# Altium schematic sheet MCU_OBDH_Transceiver.SchDoc: FloripaSat / OBDHTTC Subsystem /  OBDH Microcontroller
size A2; SheetNumber: 3; SheetTotal: 11
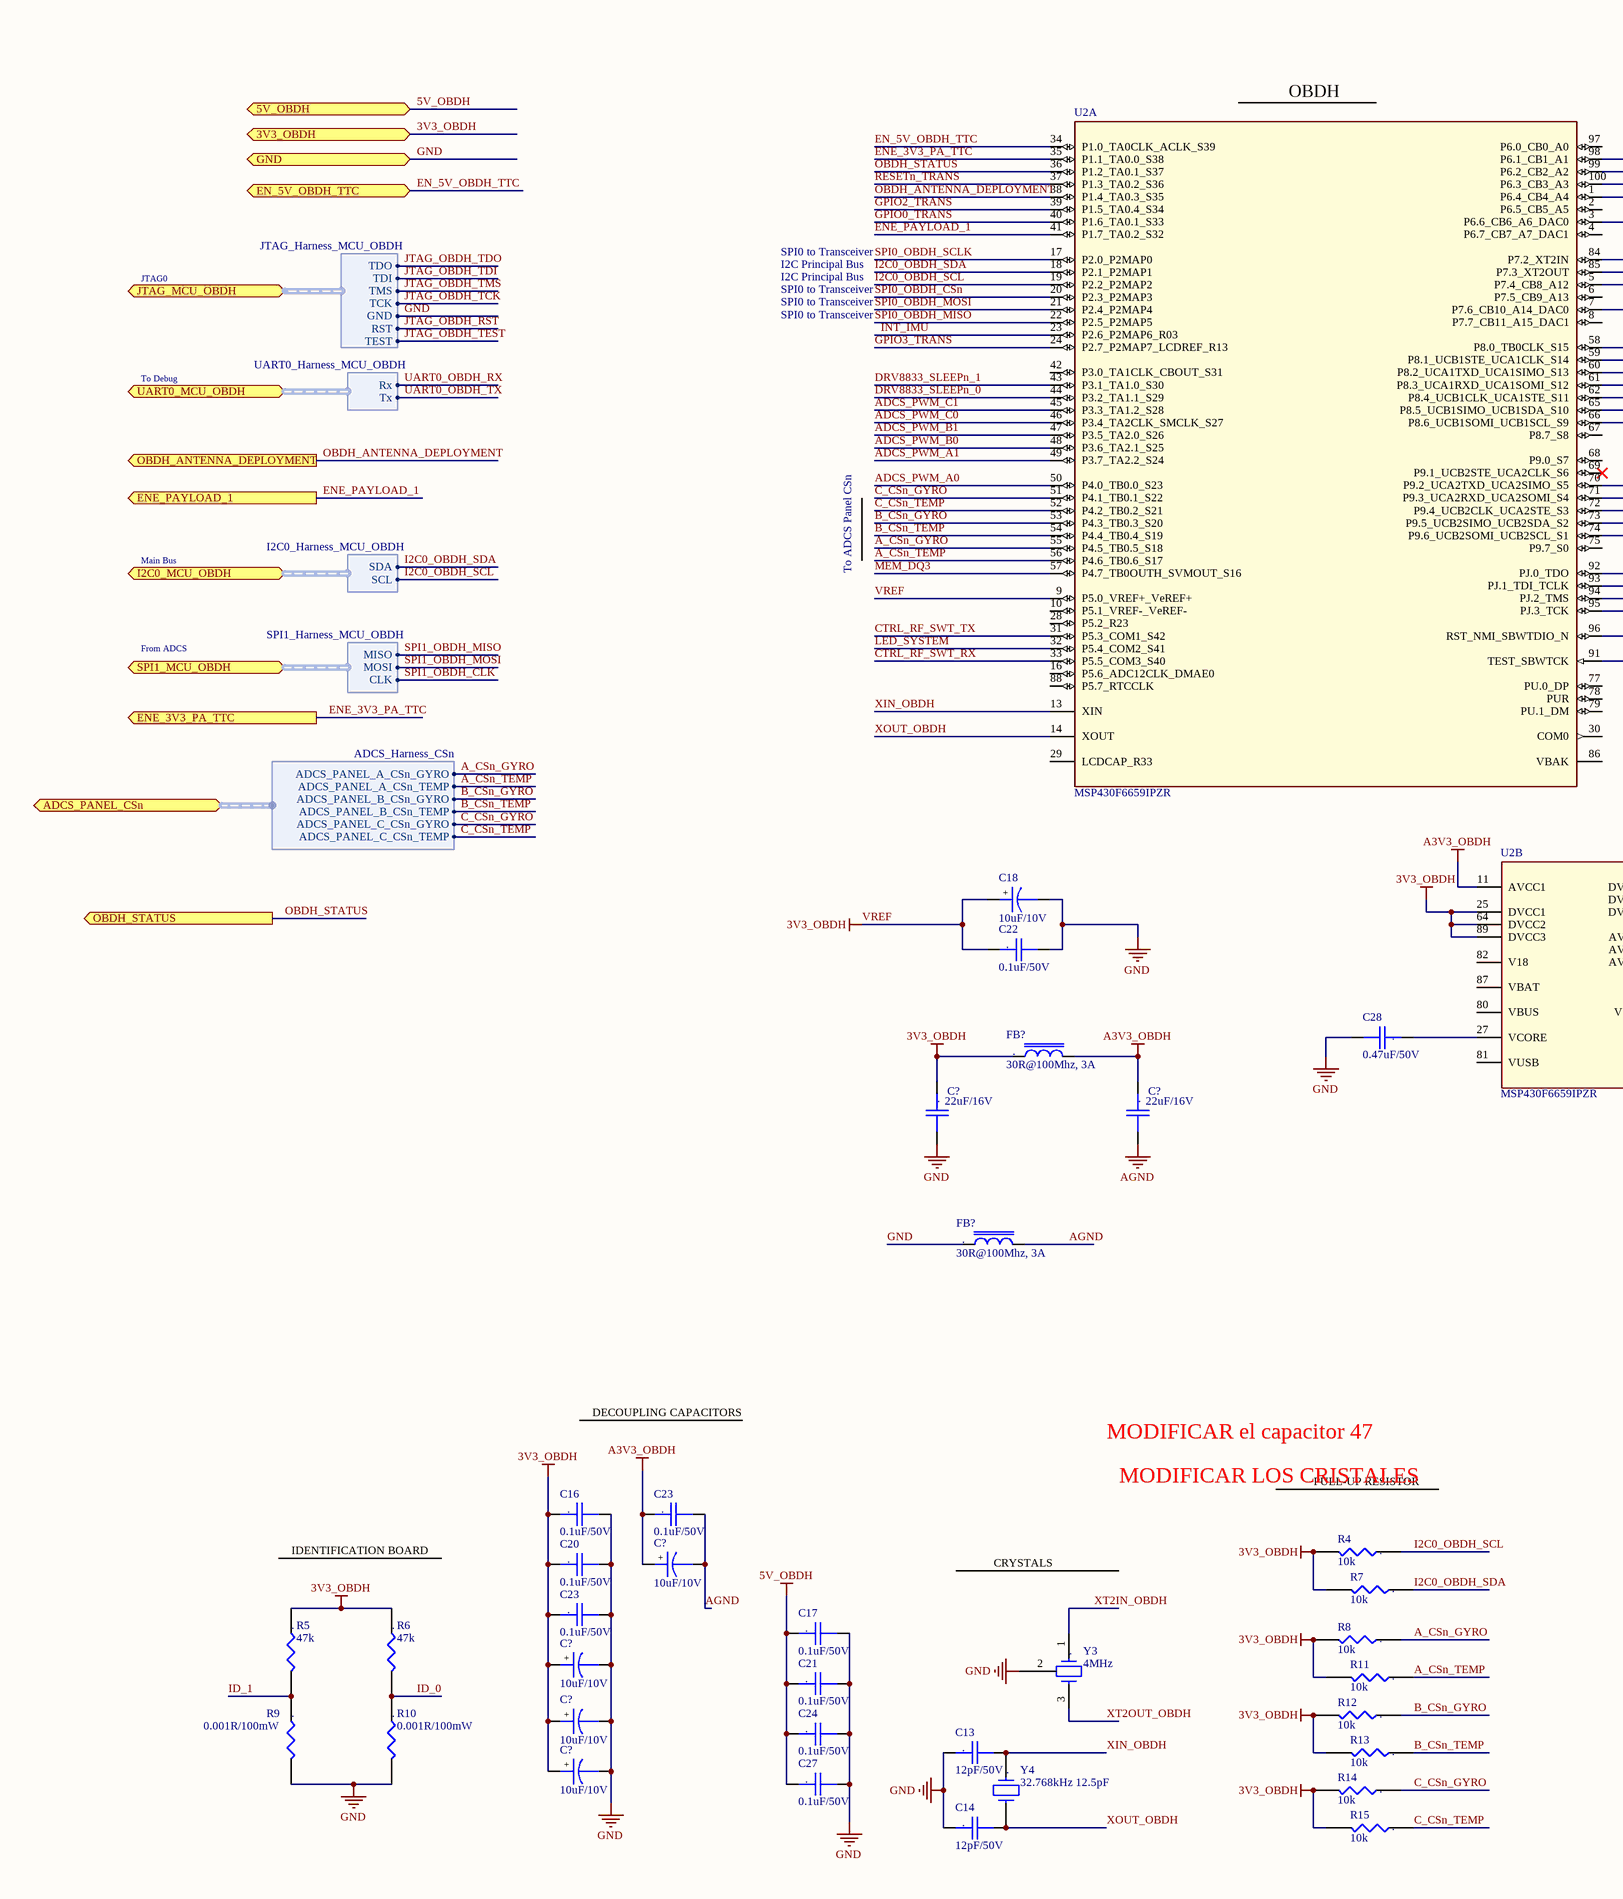
[diagram p0: MCU_OBDH_Transceiver.SchDoc, left]
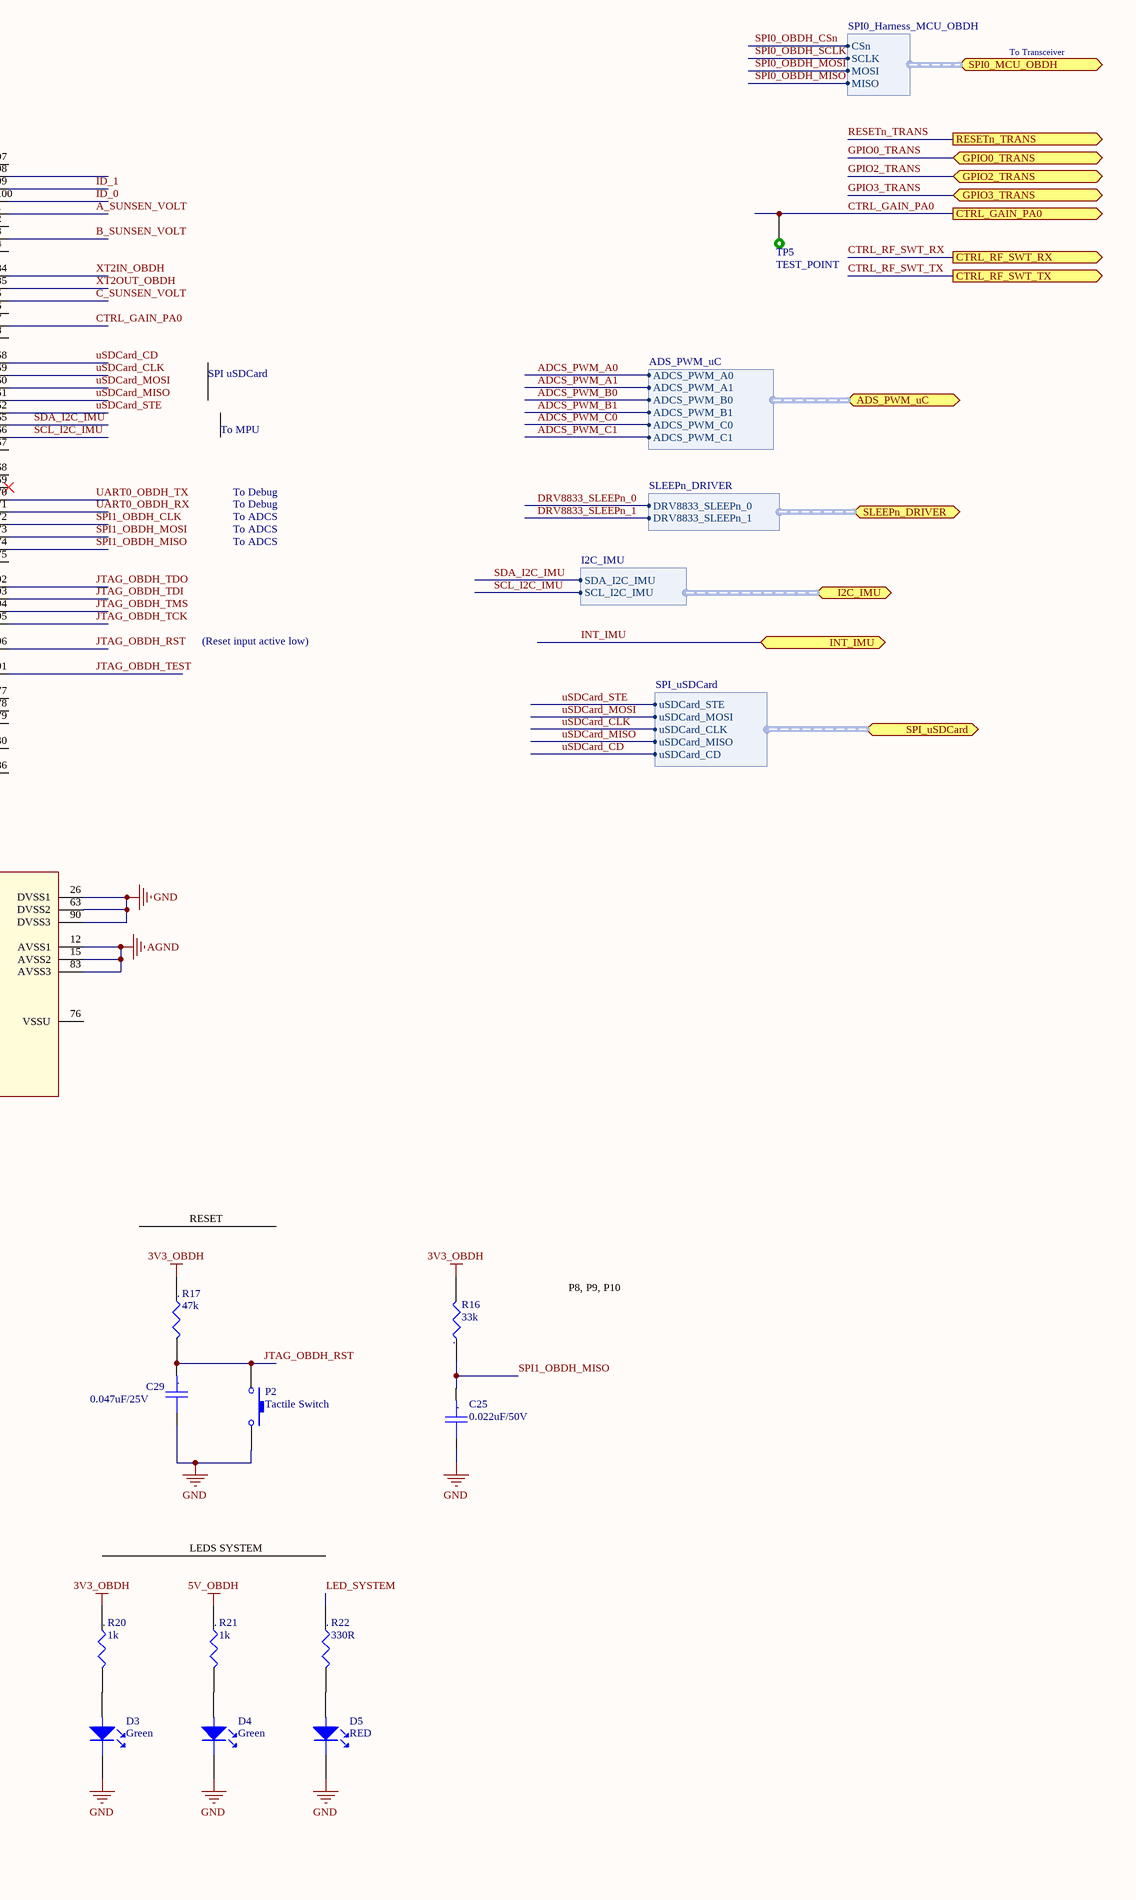
[diagram p1: MCU_OBDH_Transceiver.SchDoc, right]

## Parts
(Parts that share a designator on the sheet are numbered #1, #2 ... from top to bottom, then left to right.)
C13  12pF/50V  [CC0603]
C14  12pF/50V  [CC0603]
C16  0.1uF/50V  [CC0603]
C17  0.1uF/50V  [CC0603]
C18  10uF/10V  [CC0603_Tantalum]
C20  0.1uF/50V  [CC0603]
C21  0.1uF/50V  [CC0603]
C22  0.1uF/50V  [CC0603]
C23#1  0.1uF/50V  [CC0603]
C23#2  0.1uF/50V  [CC0603]
C24  0.1uF/50V  [CC0603]
C25  0.022uF/50V  [CC0603]
C27  0.1uF/50V  [CC0603]
C28  0.47uF/50V  [CC0603]
C29  0.047uF/25V  [CC0603]
C?#1  22uF/16V  [CC1210]
C?#2  22uF/16V  [CC1210]
C?#3  10uF/10V  [CC0805_Tantalum]
C?#4  10uF/10V  [CC0805_Tantalum]
C?#5  10uF/10V  [CC0805_Tantalum]
C?#6  10uF/10V  [CC0805_Tantalum]
D3  Green  [0603-LED]
D4  Green  [0603-LED]
D5  RED  [0603-LED]
FB?#1  30R@100Mhz, 3A  [IND0805]
FB?#2  30R@100Mhz, 3A  [IND0805]
P2  Tactile Switch  [FSMSMTR]
R4  10k  [0603]
R5  47k  [0603]
R6  47k  [0603]
R7  10k  [0603]
R8  10k  [0603]
R9  0.001R/100mW  [0603]
R10  0.001R/100mW  [0603]
R11  10k  [0603]
R12  10k  [0603]
R13  10k  [0603]
R14  10k  [0603]
R15  10k  [0603]
R16  33k  [0603]
R17  47k  [0603]
R20  1k  [0603]
R21  1k  [0603]
R22  330R  [0603]
TP5  TEST_POINT  [TEST_POINT]  (no BOM)
U2  MSP430F6659IPZR  [PZ0100A_N]  (parts A,B of 2)
Y3  4MHz  [XTAL_CSTCE_G15L]
Y4  32.768kHz 12.5pF  [ABS06 0805]

## Ports
3V3_OBDH, 5V_OBDH, ADCS_PANEL_CSn (harness ADCS_Harness_CSn), ADS_PWM_uC (harness ADS_PWM_uC), CTRL_GAIN_PA0 (out), CTRL_RF_SWT_RX (out), CTRL_RF_SWT_TX (out), EN_5V_OBDH_TTC, ENE_3V3_PA_TTC (out), ENE_PAYLOAD_1 (out), GND, GPIO0_TRANS (bidir), GPIO2_TRANS (bidir), GPIO3_TRANS (bidir), I2C0_MCU_OBDH (harness I2C0_Harness_MCU_OBDH), I2C_IMU (harness I2C_IMU), INT_IMU, JTAG_MCU_OBDH (harness JTAG_Harness_MCU_OBDH), OBDH_ANTENNA_DEPLOYMENT (out), OBDH_STATUS (out), RESETn_TRANS (out), SLEEPn_DRIVER (harness SLEEPn_DRIVER), SPI0_MCU_OBDH (harness SPI0_Harness_MCU_OBDH), SPI1_MCU_OBDH (harness SPI1_Harness_MCU_OBDH), SPI_uSDCard (harness SPI_uSDCard), UART0_MCU_OBDH (harness UART0_Harness_MCU_OBDH)

## Harnesses
SPI0_Harness_MCU_OBDH: CSn, SCLK, MOSI, MISO
JTAG_Harness_MCU_OBDH: TDO, TDI, TMS, TCK, RST, GND, TEST
I2C0_Harness_MCU_OBDH: SDA, SCL
SPI1_Harness_MCU_OBDH: MISO, CLK, MOSI
UART0_Harness_MCU_OBDH: Rx, Tx
ADCS_Harness_CSn: ADCS_PANEL_A_CSn_GYRO, ADCS_PANEL_A_CSn_TEMP, ADCS_PANEL_B_CSn_GYRO, ADCS_PANEL_B_CSn_TEMP, ADCS_PANEL_C_CSn_GYRO, ADCS_PANEL_C_CSn_TEMP
ADS_PWM_uC: ADCS_PWM_A1, ADCS_PWM_B0, ADCS_PWM_B1, ADCS_PWM_A0, ADCS_PWM_C0, ADCS_PWM_C1
SLEEPn_DRIVER: DRV8833_SLEEPn_0, DRV8833_SLEEPn_1
I2C_IMU: SCL_I2C_IMU, SDA_I2C_IMU
SPI_uSDCard: uSDCard_STE, uSDCard_CLK, uSDCard_MISO, uSDCard_CD, uSDCard_MOSI

## Nets
3V3_OBDH: C16.1 C18.1 C20.1 C22.1 C23#2.1 C?#1.1 C?#4.1 C?#5.1 C?#6.1 FB?#1.1 R4.2 R5.1 R6.1 R7.2 R8.2 R11.2 R12.2 R13.2 R14.2 R15.2 R16.2 R17.1 R20.1 U2.9(P5.0_VREF+_VeREF+) U2.25(DVCC1) U2.64(DVCC2) U2.89(DVCC3) ; port 3V3_OBDH  [also labelled VREF]
5V_OBDH: C17.1 C21.1 C24.1 C27.1 R21.1 ; port 5V_OBDH
A3V3_OBDH: C23#1.1 C?#2.1 C?#3.1 FB?#1.2 U2.11(AVCC1)
AGND: C23#1.2 C?#2.2 C?#3.2 FB?#2.2 U2.12(AVSS1) U2.15(AVSS2) U2.83(AVSS3)
GND: C13.1 C14.1 C16.2 C17.2 C18.2 C20.2 C21.2 C22.2 C23#2.2 C24.2 C25.2 C27.2 C28.2 C29.2 C?#1.2 C?#4.2 C?#5.2 C?#6.2 D3.2(K) D4.2(K) D5.2(K) FB?#2.1 P2.2 R9.2 R10.2 U2.26(DVSS1) U2.63(DVSS2) U2.90(DVSS3) Y3.2 ; port GND, port JTAG_MCU_OBDH.GND
A_CSn_GYRO: R8.1 U2.55(P4.5_TB0.5_S18) ; port ADCS_PANEL_CSn.ADCS_PANEL_A_CSn_GYRO
A_CSn_TEMP: R11.1 U2.56(P4.6_TB0.6_S17) ; port ADCS_PANEL_CSn.ADCS_PANEL_A_CSn_TEMP
A_SUNSEN_VOLT: U2.1(P6.4_CB4_A4)
ADCS_PWM_A0: U2.50(P4.0_TB0.0_S23) ; port ADS_PWM_uC.ADCS_PWM_A0
ADCS_PWM_A1: U2.49(P3.7_TA2.2_S24) ; port ADS_PWM_uC.ADCS_PWM_A1
ADCS_PWM_B0: U2.48(P3.6_TA2.1_S25) ; port ADS_PWM_uC.ADCS_PWM_B0
ADCS_PWM_B1: U2.47(P3.5_TA2.0_S26) ; port ADS_PWM_uC.ADCS_PWM_B1
ADCS_PWM_C0: U2.46(P3.4_TA2CLK_SMCLK_S27) ; port ADS_PWM_uC.ADCS_PWM_C0
ADCS_PWM_C1: U2.45(P3.3_TA1.2_S28) ; port ADS_PWM_uC.ADCS_PWM_C1
B_CSn_GYRO: R12.1 U2.53(P4.3_TB0.3_S20) ; port ADCS_PANEL_CSn.ADCS_PANEL_B_CSn_GYRO
B_CSn_TEMP: R13.1 U2.54(P4.4_TB0.4_S19) ; port ADCS_PANEL_CSn.ADCS_PANEL_B_CSn_TEMP
B_SUNSEN_VOLT: U2.3(P6.6_CB6_A6_DAC0)
C_CSn_GYRO: R14.1 U2.51(P4.1_TB0.1_S22) ; port ADCS_PANEL_CSn.ADCS_PANEL_C_CSn_GYRO
C_CSn_TEMP: R15.1 U2.52(P4.2_TB0.2_S21) ; port ADCS_PANEL_CSn.ADCS_PANEL_C_CSn_TEMP
C_SUNSEN_VOLT: U2.5(P7.4_CB8_A12)
CTRL_GAIN_PA0: TP5.1 U2.7(P7.6_CB10_A14_DAC0) ; port CTRL_GAIN_PA0
CTRL_RF_SWT_RX: U2.33(P5.5_COM3_S40) ; port CTRL_RF_SWT_RX
CTRL_RF_SWT_TX: U2.31(P5.3_COM1_S42) ; port CTRL_RF_SWT_TX
DRV8833_SLEEPn_0: U2.44(P3.2_TA1.1_S29) ; port SLEEPn_DRIVER.DRV8833_SLEEPn_0
DRV8833_SLEEPn_1: U2.43(P3.1_TA1.0_S30) ; port SLEEPn_DRIVER.DRV8833_SLEEPn_1
EN_5V_OBDH_TTC: U2.34(P1.0_TA0CLK_ACLK_S39) ; port EN_5V_OBDH_TTC
ENE_3V3_PA_TTC: U2.35(P1.1_TA0.0_S38) ; port ENE_3V3_PA_TTC
ENE_PAYLOAD_1: U2.41(P1.7_TA0.2_S32) ; port ENE_PAYLOAD_1
GPIO0_TRANS: U2.40(P1.6_TA0.1_S33) ; port GPIO0_TRANS
GPIO2_TRANS: U2.39(P1.5_TA0.4_S34) ; port GPIO2_TRANS
GPIO3_TRANS: U2.24(P2.7_P2MAP7_LCDREF_R13) ; port GPIO3_TRANS
I2C0_OBDH_SCL: R4.1 U2.19(P2.2_P2MAP2) ; port I2C0_MCU_OBDH.SCL
I2C0_OBDH_SDA: R7.1 U2.18(P2.1_P2MAP1) ; port I2C0_MCU_OBDH.SDA
ID_0: R6.2 R10.1 U2.100(P6.3_CB3_A3)
ID_1: R5.2 R9.1 U2.99(P6.2_CB2_A2)
INT_IMU: U2.23(P2.6_P2MAP6_R03) ; port INT_IMU
JTAG_OBDH_RST: C29.1 P2.1 R17.2 U2.96(RST_NMI_SBWTDIO_N) ; port JTAG_MCU_OBDH.RST
JTAG_OBDH_TCK: U2.95(PJ.3_TCK) ; port JTAG_MCU_OBDH.TCK
JTAG_OBDH_TDI: U2.93(PJ.1_TDI_TCLK) ; port JTAG_MCU_OBDH.TDI
JTAG_OBDH_TDO: U2.92(PJ.0_TDO) ; port JTAG_MCU_OBDH.TDO
JTAG_OBDH_TEST: U2.91(TEST_SBWTCK) ; port JTAG_MCU_OBDH.TEST
JTAG_OBDH_TMS: U2.94(PJ.2_TMS) ; port JTAG_MCU_OBDH.TMS
LED_SYSTEM: R22.1 U2.32(P5.4_COM2_S41)
MEM_DQ3: U2.57(P4.7_TB0OUTH_SVMOUT_S16)
OBDH_ANTENNA_DEPLOYMENT: U2.38(P1.4_TA0.3_S35) ; port OBDH_ANTENNA_DEPLOYMENT
OBDH_STATUS: U2.36(P1.2_TA0.1_S37) ; port OBDH_STATUS
RESETn_TRANS: U2.37(P1.3_TA0.2_S36) ; port RESETn_TRANS
SCL_I2C_IMU: U2.66(P8.6_UCB1SOMI_UCB1SCL_S9) ; port I2C_IMU.SCL_I2C_IMU
SDA_I2C_IMU: U2.65(P8.5_UCB1SIMO_UCB1SDA_S10) ; port I2C_IMU.SDA_I2C_IMU
SPI0_OBDH_CSn: U2.20(P2.3_P2MAP3) ; port SPI0_MCU_OBDH.CSn
SPI0_OBDH_MISO: U2.22(P2.5_P2MAP5) ; port SPI0_MCU_OBDH.MISO
SPI0_OBDH_MOSI: U2.21(P2.4_P2MAP4) ; port SPI0_MCU_OBDH.MOSI
SPI0_OBDH_SCLK: U2.17(P2.0_P2MAP0) ; port SPI0_MCU_OBDH.SCLK
SPI1_OBDH_CLK: U2.72(P9.4_UCB2CLK_UCA2STE_S3) ; port SPI1_MCU_OBDH.CLK
SPI1_OBDH_MISO: C25.1 R16.1 U2.74(P9.6_UCB2SOMI_UCB2SCL_S1) ; port SPI1_MCU_OBDH.MISO
SPI1_OBDH_MOSI: U2.73(P9.5_UCB2SIMO_UCB2SDA_S2) ; port SPI1_MCU_OBDH.MOSI
UART0_OBDH_RX: U2.71(P9.3_UCA2RXD_UCA2SOMI_S4) ; port UART0_MCU_OBDH.Rx
UART0_OBDH_TX: U2.70(P9.2_UCA2TXD_UCA2SIMO_S5) ; port UART0_MCU_OBDH.Tx
uSDCard_CD: U2.58(P8.0_TB0CLK_S15) ; port SPI_uSDCard.uSDCard_CD
uSDCard_CLK: U2.59(P8.1_UCB1STE_UCA1CLK_S14) ; port SPI_uSDCard.uSDCard_CLK
uSDCard_MISO: U2.61(P8.3_UCA1RXD_UCA1SOMI_S12) ; port SPI_uSDCard.uSDCard_MISO
uSDCard_MOSI: U2.60(P8.2_UCA1TXD_UCA1SIMO_S13) ; port SPI_uSDCard.uSDCard_MOSI
uSDCard_STE: U2.62(P8.4_UCB1CLK_UCA1STE_S11) ; port SPI_uSDCard.uSDCard_STE
XIN_OBDH: C13.2 U2.13(XIN) Y4.1
XOUT_OBDH: C14.2 U2.14(XOUT) Y4.2
XT2IN_OBDH: U2.84(P7.2_XT2IN) Y3.1
XT2OUT_OBDH: U2.85(P7.3_XT2OUT) Y3.3
NetC28_1: C28.1 U2.27(VCORE)
NetD3_1: D3.1(A) R20.2
NetD4_1: D4.1(A) R21.2
NetD5_1: D5.1(A) R22.2

Not connected (* = marked no-connect by the designer): U2 2(P6.5_CB5_A5) 4(P6.7_CB7_A7_DAC1) 6(P7.5_CB9_A13) 8(P7.7_CB11_A15_DAC1) 10(P5.1_VREF-_VeREF-) 16(P5.6_ADC12CLK_DMAE0) 28(P5.2_R23) 29(LCDCAP_R33) 30(COM0) 42(P3.0_TA1CLK_CBOUT_S31) 67(P8.7_S8) 68(P9.0_S7) 69(P9.1_UCB2STE_UCA2CLK_S6)* 75(P9.7_S0) 76(VSSU) 77(PU.0_DP) 78(PUR) 79(PU.1_DM) 80(VBUS) 81(VUSB) 82(V18) 86(VBAK) 87(VBAT) 88(P5.7_RTCCLK) 97(P6.0_CB0_A0) 98(P6.1_CB1_A1)

## Notes on the sheet
- To Transceiver
- (near U2) OBDH
- JTAG0
- SPI0 to Transceiver
- I2C Principal Bus
- SPI uSDCard
- To Debug
- To MPU
- Main Bus
- To ADCS
- To ADCS Panel CSn
- From ADCS
- (Reset input active low)
- RESET
- P8, P9, P10
- DECOUPLING CAPACITORS
- MODIFICAR el capacitor 47
- MODIFICAR LOS CRISTALES
- PULL-UP RESISTOR
- IDENTIFICATION BOARD
- LEDS SYSTEM
- CRYSTALS
- (in symbol Cap_Cer_X7R_0.01uF_16V_1210) .
- (in symbol Cap_Cer_X7R_0.1uF_50V_0603) .
- (in symbol Cap_Cer_X7R_0.022uF_50V_0603) .
- (in symbol Cap_Cer_X7R_0.047uF_25V_0603) .
- (in symbol Cap_Cer_X7R_0.47uF_50V_0603) .
- (in symbol Cap_Cer_X7R_12pF_50V_0603) .
- (in symbol Cap_Tant_SMD_10uF_6V3_0805) +
- (in symbol Cap_Tant_SMD_10uF_10V_0603) +
- (in symbol FB_30R_3A_100MHz_0805) .
- (in symbol R0.001R_1%_100mW_0603) .
- (in symbol R1.0k_1%_1/8W_0603) .
- (in symbol R10k_1%_1/8W_0603) .
- (in symbol R33k_1%_1/10W_0603) .
- (in symbol R47k_1%_1/8W_0603) .
- (in symbol R330R_1%_1/4W_0603) .
- (in symbol Xtal_4MHz_SMD) .
- (in symbol Xtal_32.768kHz_12.5pF_SMD) .

## Library data of the parts
C13 C14 = Cap_Cer_X7R_12pF_50V_0603: CAP CER 12pF 50V 0603; Partnumber: GQM1885C1H120GB01D; NCM: 8532.24.10
C16 C17 C20-C22 C23#1 C23#2 C24 C27 = Cap_Cer_X7R_0.1uF_50V_0603: CAP CER 0.1UF 50V 10% X7R 0603; Partnumber: C1608X7R1H104K; NCM: 8532.24.10
C18 = Cap_Tant_SMD_10uF_10V_0603: CAP Tantalum 10uF 10V 10% 0603; Partnumber: TACL106K010XTA; NCM: 8532.21.11
C25 = Cap_Cer_X7R_0.022uF_50V_0603: CAP CER 0.022UF 50V 5% X7R 0603; Partnumber: 06035C223JAT2A; NCM: 8532.24.10
C28 = Cap_Cer_X7R_0.47uF_50V_0603: CAP CER 0.47UF 50V 10% X7R 0603; Partnumber: C1608X7R1H474K; NCM: 8532.24.10
C29 = Cap_Cer_X7R_0.047uF_25V_0603: CAP CER 0.047UF 25V 0603; Partnumber: GCM188R71E473KA37D; NCM: 8532.24.10
C?#1 C?#2 = Cap_Cer_X7R_0.01uF_16V_1210: CAP CER 22uF 16V 10% X7R 1210; Partnumber: C3225X7R1C226K250AC; NCM: 8532.24.10
C?#3-C?#6 = Cap_Tant_SMD_10uF_6V3_0805: CAP Tantalum 10uF 6.3V 10% 0805; Partnumber: TPSR106K006R1000; NCM: 8532.21.11
D3 D4 = LED/G_0603: SMD Green LED; Partnumber: 150060VS75000; NCM: 8541.40.21
D5 = LED/R_0603: SMD Red LED; Partnumber: LTST-C191KFKT; NCM: 8541.40.21
FB?#1 FB?#2 = FB_30R_3A_100MHz_0805: Ferrite Bead 30 OHM 3A 100MHz; Partnumber: BLM21PG300SN1D; NCM: 8504.50.00
P2 = FSMSMTR: Tactile Switches TACTILE SWITCH 12VDC 1.77N; Manufacturer: TE Connectivity; Partnumber: FSMSMTR
R4 R7 R8 R11-R15 = R10k_1%_1/8W_0603: RES 10K OHM 1/8W 1%  0603; Partnumber: MCT0603MC1002FP500; NCM: 8533.21.20
R5 R6 R17 = R47k_1%_1/8W_0603: RES 47K OHM 1/8W 0.5% 0603; Partnumber: MCT0603MD4702DP500; NCM: 8533.21.20
R9 R10 = R0.001R_1%_100mW_0603: RES 0.001 OHM 100mW 1% 0603; Partnumber: MCT06030C1008FP500; NCM: 8533.21.20
R16 = R33k_1%_1/10W_0603: RES 33K OHM 1/10W 1% 0603; Partnumber: RC0603FR-0733KL; NCM: 8533.21.20
R20 R21 = R1.0k_1%_1/8W_0603: RES 1.0K OHM 1/8W 1% 0603; Partnumber: MCT06030C1001FP500; NCM: 8533.21.20
R22 = R330R_1%_1/4W_0603: RES 330R OHM 1/4W 1% 0603; Partnumber: CRCW0603330RFKEAHP; NCM: 8533.21.20
TP5 = TEST_POINT: Test point
U2 = MSP430F6659IPZR: Imported; Manufacturer: Texas Instruments; CompType: IC; PIN_COUNT: 100; Application_BuildNumber: *; PartNumber: MSP430F6659IPZR; Alternate PartNumber: MSP430F6659IPZ; PackageReference: PZ0100A; MountType: SMT; RoHS: Y; RefDes: RefDes; Type: DEV; Value: Value
Y3 = Xtal_4MHz_SMD: CER RESONATOR  4MHz SMD Murata; Partnumber: CSTCR4M00G15L99-R0; NCM: 8541.60.10
Y4 = Xtal_32.768kHz_12.5pF_SMD: CRYSTAL 32.768KHZ 12.5PF SMD; Partnumber: ABS06-32.768KHZ-T; NCM: 8541.60.10